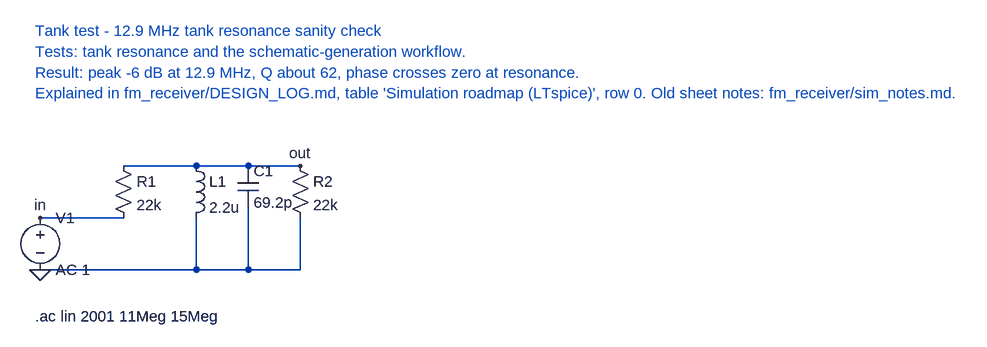
[diagram p0: schematic slope_tank_test.asc]
slope_tank_test.asc, the LTspice schematic file:
Version 4
SHEET 1 880 680
WIRE 208 112 80 112
WIRE 320 32 208 32
WIRE 400 32 320 32
WIRE 480 32 400 32
WIRE 320 192 320 112
WIRE 400 192 400 96
WIRE 480 192 480 112
WIRE 320 192 80 192
WIRE 400 192 320 192
WIRE 480 192 400 192
FLAG 80 192 0
FLAG 80 112 in
FLAG 480 32 out
SYMBOL voltage 80 96 R0
SYMATTR InstName V1
SYMATTR Value AC 1
SYMBOL res 192 16 R0
SYMATTR InstName R1
SYMATTR Value 22k
SYMBOL ind 304 16 R0
SYMATTR InstName L1
SYMATTR Value 2.2u
SYMBOL cap 384 32 R0
SYMATTR InstName C1
SYMATTR Value 69.2p
SYMBOL res 464 16 R0
SYMATTR InstName R2
SYMATTR Value 22k
TEXT 72 264 Left 2 !.ac lin 2001 11Meg 15Meg
TEXT 72 -176 Left 2 ;Tank test - 12.9 MHz tank resonance sanity check
TEXT 72 -144 Left 2 ;Tests: tank resonance and the schematic-generation workflow.
TEXT 72 -112 Left 2 ;Result: peak -6 dB at 12.9 MHz, Q about 62, phase crosses zero at resonance.
TEXT 72 -80 Left 2 ;Explained in fm_receiver/DESIGN_LOG.md, table 'Simulation roadmap (LTspice)', row 0. Old sheet notes: fm_receiver/sim_notes.md.

The netlist it stands for:
* slope_tank_test.asc
V1 in 0 AC 1
R1 out in 22k
L1 out 0 2.2u
C1 out 0 69.2p
R2 out 0 22k
.ac lin 2001 11Meg 15Meg
* Tank test - 12.9 MHz tank resonance sanity check
* Tests: tank resonance and the schematic-generation workflow.
* Result: peak -6 dB at 12.9 MHz, Q about 62, phase crosses zero at resonance.
* Explained in fm_receiver/DESIGN_LOG.md, table 'Simulation roadmap (LTspice)', row 0. Old sheet notes: fm_receiver/sim_notes.md.
.backanno
.end